# EAGLE design tracker (EAGLE 6.5.0)
GPS and Radio Tracker for Hot Air Balloon Flights Based on ATMega328p Microcrontroller and Raspberry Pi
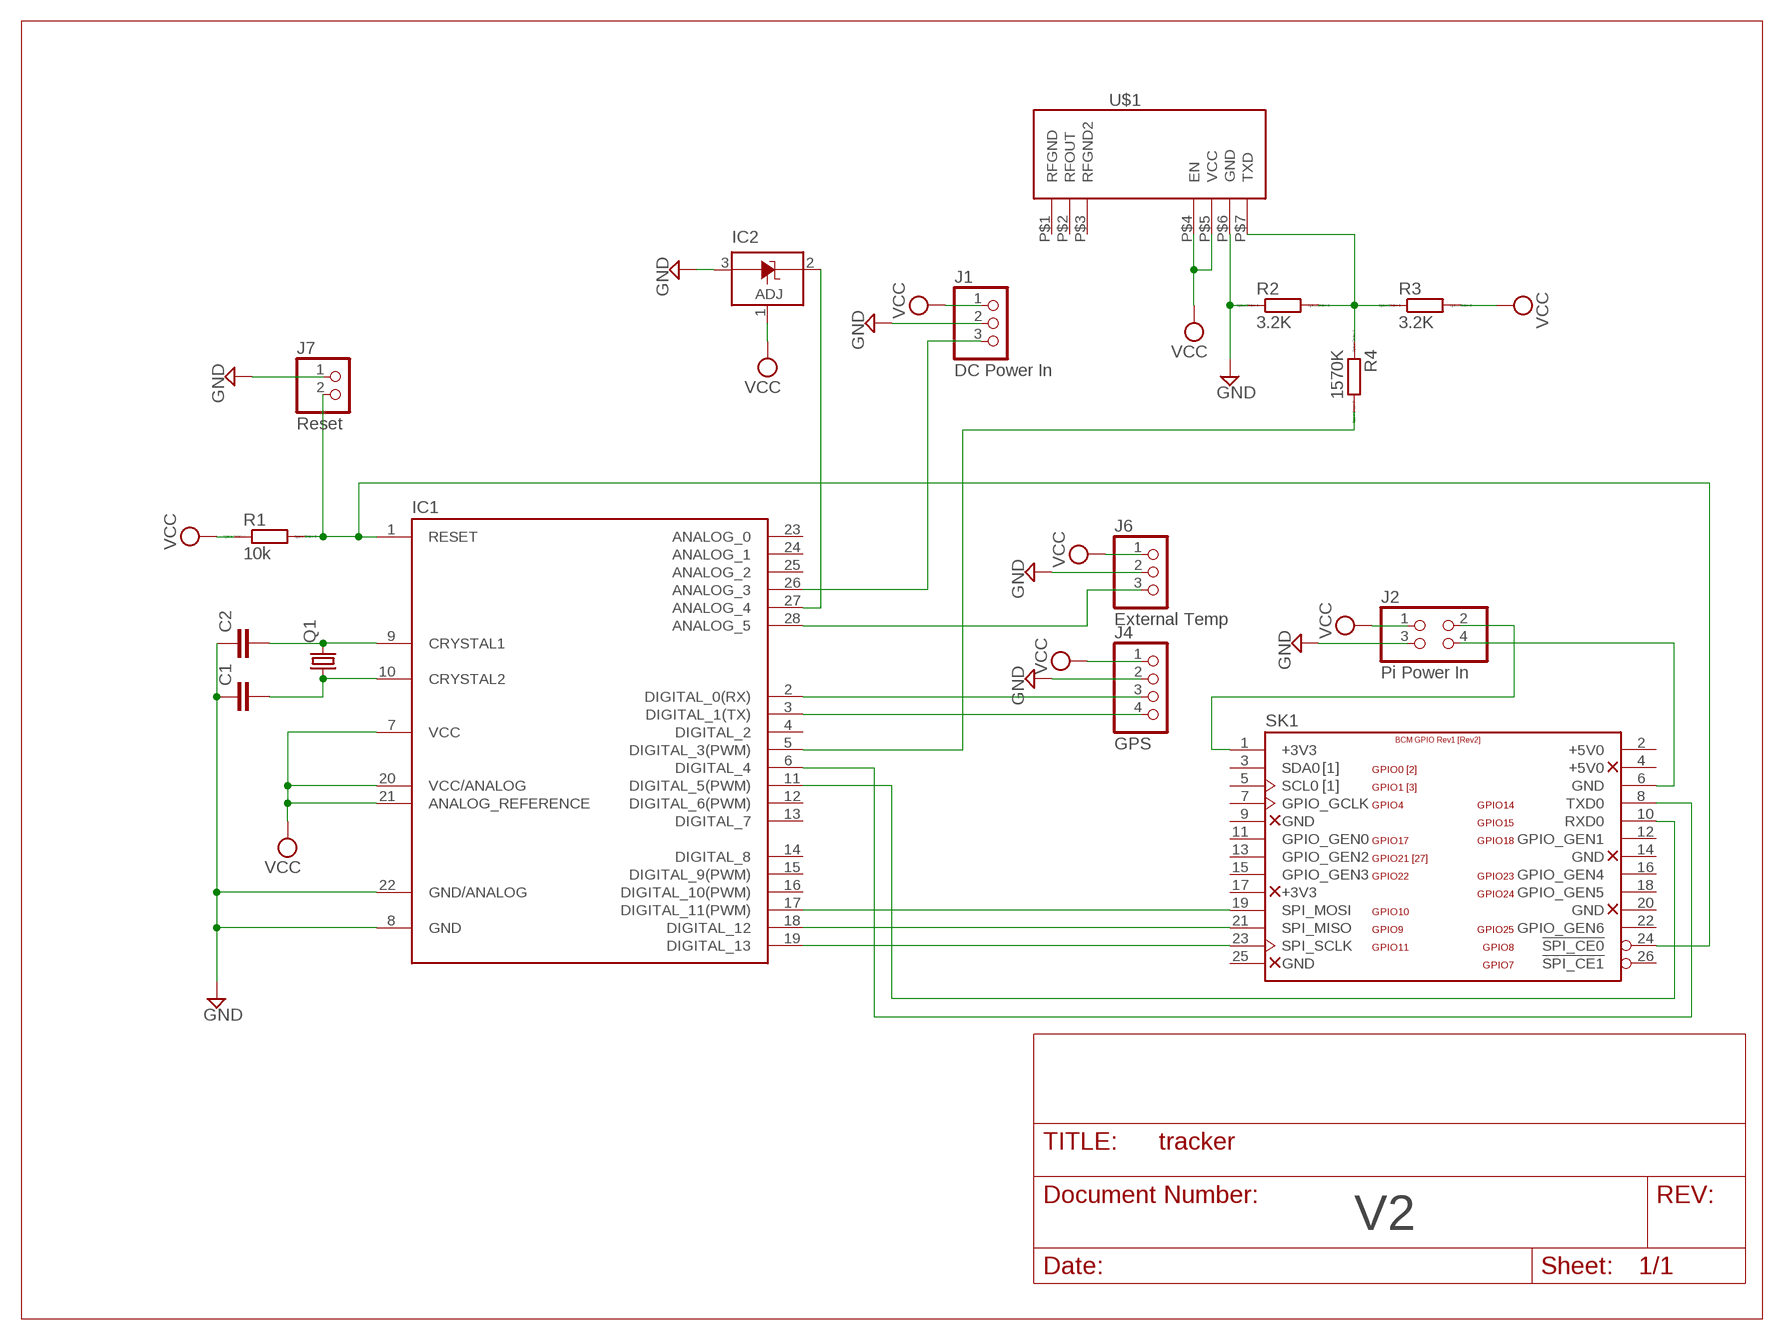
[diagram p0: schematic, sheet 1]

## Parts
C1  C-EU025-025X050  [C025-025X050]
C2  C-EU025-025X050  [C025-025X050]
IC1  ATMEGA168-PU  [DIL28-3]
IC2  LM336LP  [TO92]
J1  DC Power In  PINHD-1X3  [1X03]
J2  Pi Power In  PINHD-2X2  [2X02]
J4  GPS  PINHD-1X4  [1X04]
J6  External Temp  PINHD-1X3  [1X03]
J7  Reset  PINHD-1X2  [1X02]
Q1  CRYSTALHC49S  [HC49/S]
R1  10k  R0207/10  [0207/10]
R2  3.2K  R0207/10  [0207/10]
R3  3.2K  R0207/10  [0207/10]
R4  1570K  R0207/10  [0207/10]
SK1  PI-GPIO-PTH  [GPIO-CONNECTOR]
U$1  NTX2  [NTX2]

## Nets
GND: C1.1 C2.1 IC1.8(GND) IC1.22(GND/ANALOG) IC2.3(A) J1.2 J2.3 J4.2 J6.2 J7.1 R2.1 U$1.P$6(GND)
N$1: C2.2 IC1.9(CRYSTAL1) Q1.2
N$2: C1.2 IC1.10(CRYSTAL2) Q1.1
N$3: IC1.2(DIGITAL_0(RX)) J4.3
N$4: IC1.11(DIGITAL_5(PWM)) SK1.10(RXD0)
N$5: IC1.1(RESET) J7.2 R1.2 SK1.24(!SPI_CE0)
N$6: IC1.17(DIGITAL_11(PWM)) SK1.19(SPI_MOSI)
N$7: IC1.18(DIGITAL_12) SK1.21(SPI_MISO)
N$8: IC1.19(DIGITAL_13) SK1.23(SPI_SCLK)
N$9: IC1.3(DIGITAL_1(TX)) J4.4
N$10: IC1.5(DIGITAL_3(PWM)) R4.2
N$11: J2.2 SK1.1(+3V3)
N$12: J2.4 SK1.6(GND)
N$13: IC1.27(ANALOG_4) IC2.2(C)
N$14: IC1.26(ANALOG_3) J1.3
N$15: IC1.28(ANALOG_5) J6.3
N$16: R2.2 R3.1 R4.1 U$1.P$7(TXD)
N$17: IC1.6(DIGITAL_4) SK1.8(TXD0)
VCC: IC1.7(VCC) IC1.20(VCC/ANALOG) IC1.21(ANALOG_REFERENCE) IC2.1(ADJ) J1.1 J2.1 J4.1 J6.1 R1.1 R3.2 U$1.P$4(EN) U$1.P$5(VCC)
Unconnected: IC1.4(DIGITAL_2) IC1.12(DIGITAL_6(PWM)) IC1.13(DIGITAL_7) IC1.14(DIGITAL_8) IC1.15(DIGITAL_9(PWM)) IC1.16(DIGITAL_10(PWM)) IC1.23(ANALOG_0) IC1.24(ANALOG_1) IC1.25(ANALOG_2) SK1.3(SDA0) SK1.4(+5V0) SK1.5(SCL0) SK1.7(GPIO_GCLK) SK1.9(GND) SK1.11(GPIO_GEN0) SK1.12(GPIO_GEN1) SK1.13(GPIO_GEN2) SK1.14(GND) SK1.15(GPIO_GEN3) SK1.16(GPIO_GEN4) SK1.17(+3V3) SK1.18(GPIO_GEN5) SK1.20(GND) SK1.22(GPIO_GEN6) SK1.25(GND) SK1.26(!SPI_CE1) U$1.P$1(RFGND) U$1.P$2(RFOUT) U$1.P$3(RFGND2)

## Notes on the sheet
- V2

## Power pins joined to a net without a drawn wire
+5V0: SK1.2(+5V0)

## Library data of the parts
C1 C2 = rcl:C-EU: CAPACITOR, European symbol
IC1 = Arduino-AVR:ATMEGA168-PU
IC2 = linear:LM336: 2.5-V INTEGRATED REFERENCE CIRCUITS LM236 Source: http://focus.ti.com/lit/ds/symlink/lm336-2.5.pdf
J1 J6 = pinhead:PINHD-1X3: PIN HEADER
J2 = pinhead:PINHD-2X2: PIN HEADER
J4 = pinhead:PINHD-1X4: PIN HEADER
J7 = pinhead:PINHD-1X2: PIN HEADER
Q1 = crystal:CRYSTAL: CRYSTAL; OC_FARNELL: 1667008; OC_NEWARK: unknown
R1-R4 = eagle-ltspice:R: RESISTOR, European symbol; SPICEMODEL: NONE; SPICEPREFIX: R
SK1 = jt-raspberry-pi:PI-: Raspberry Pi
U$1 = Icarus:NTX2

## Board
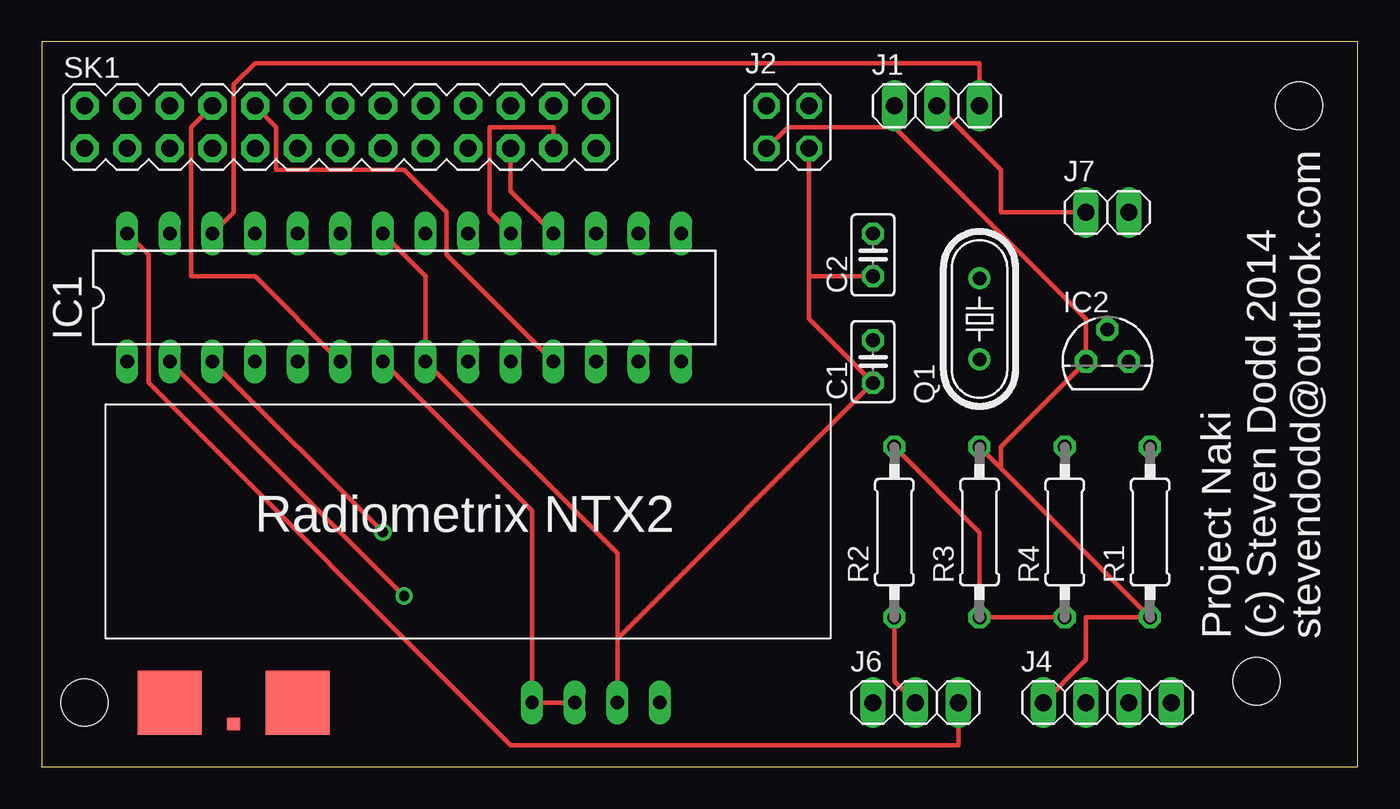
[diagram p1: board, top side]
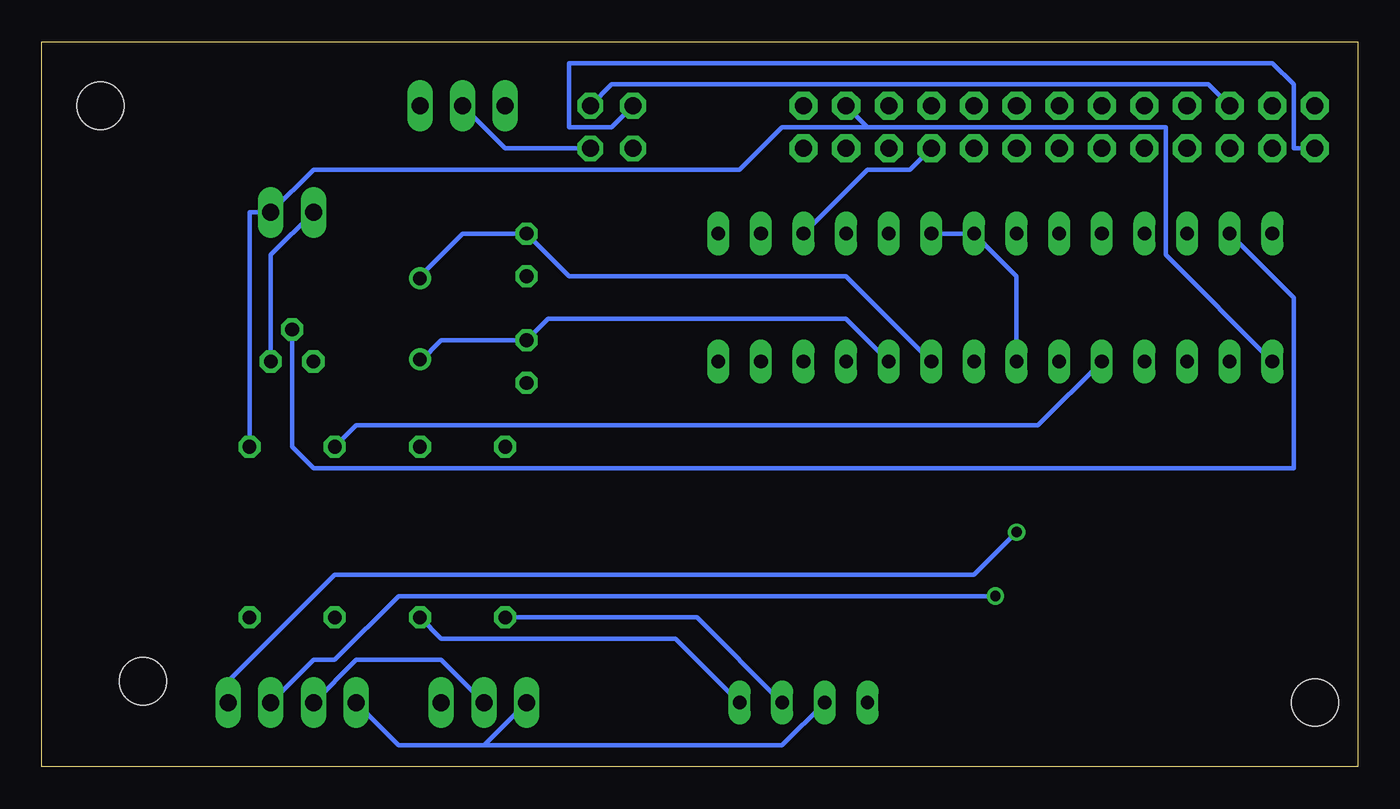
[diagram p2: board, bottom side, seen from below]

Size 78.41 x 43.17 mm. Coordinates in mm from the lower left corner, seen from the top.
Outline: 0,0 78.41,0 78.41,43.17 0,43.17 0,0
Copper layers (1*16): Top 0.035mm / dielectric 1.5mm / Bottom 0.035mm
Design rules "default": minimum track width 10mil, minimum drill 24mil, track to track 8mil, track to pad 8mil, pad to pad 8mil, via to via 8mil, smd to smd 8mil, copper to edge 40mil, drill to drill 8mil, minimum pad ring 10mil, minimum via ring 8mil, stop-mask expansion 4mil, vias tented up to drill 0mil, thermal gap 10mil
Holes 2.8 mm at 2.54,3.81 74.93,39.37 72.39,5.08

### Footprints (pad centres in the part's own frame; a part is rotated, then mirrored left to right if it is on the bottom)
C025-025X050 = drill 0.813 octagon: 1 -1.27,0; 2 1.27,0
DIL28-3 = drill 0.813 long: 1 -16.51,-3.81; 2 -13.97,-3.81; 3 -11.43,-3.81; 4 -8.89,-3.81; 5 -6.35,-3.81; 6 -3.81,-3.81; 7 -1.27,-3.81; 8 1.27,-3.81; 9 3.81,-3.81; 10 6.35,-3.81; 11 8.89,-3.81; 12 11.43,-3.81; 13 13.97,-3.81; 14 16.51,-3.81; 15 16.51,3.81; 16 13.97,3.81; 17 11.43,3.81; 18 8.89,3.81; 19 6.35,3.81; 20 3.81,3.81; 21 1.27,3.81; 22 -1.27,3.81; 23 -3.81,3.81; 24 -6.35,3.81; 25 -8.89,3.81; 26 -11.43,3.81; 27 -13.97,3.81; 28 -16.51,3.81
TO92 = drill 0.813 octagon: 1 -1.27,0; 2 0,1.905; 3 1.27,0
1X03 = drill 1.016 long: 1 -2.54,0; 2 0,0; 3 2.54,0
2X02 = drill 1.016 octagon: 1 -1.27,-1.27; 2 -1.27,1.27; 3 1.27,-1.27; 4 1.27,1.27
1X04 = drill 1.016 long: 1 -3.81,0; 2 -1.27,0; 3 1.27,0; 4 3.81,0
1X02 = drill 1.016 long: 1 -1.27,0; 2 1.27,0
HC49/S = drill 0.813: 1 -2.413,0; 2 2.413,0
0207/10 = drill 0.813 octagon: 1 -5.08,0; 2 5.08,0
GPIO-CONNECTOR = drill 1.016 pad 1.676 octagon: 1 -15.24,-1.27; 2 -15.24,1.27; 3 -12.7,-1.27; 4 -12.7,1.27; 5 -10.16,-1.27; 6 -10.16,1.27; 7 -7.62,-1.27; 8 -7.62,1.27; 9 -5.08,-1.27; 10 -5.08,1.27; 11 -2.54,-1.27; 12 -2.54,1.27; 13 0,-1.27; 14 0,1.27; 15 2.54,-1.27; 16 2.54,1.27; 17 5.08,-1.27; 18 5.08,1.27; 19 7.62,-1.27; 20 7.62,1.27; 21 10.16,-1.27; 22 10.16,1.27; 23 12.7,-1.27; 24 12.7,1.27; 25 15.24,-1.27; 26 15.24,1.27
NTX2 = smd 3.81 x 3.81: P$1 -11.43,-11.43; P$3 -3.81,-11.43 | smd 0.762 x 0.762: P$2 -7.62,-12.7 | drill 0.8 long: P$4 10.16,-11.43; P$5 12.7,-11.43; P$6 15.24,-11.43; P$7 17.78,-11.43

### Placement (x,y rotation side)
C1  49.53,24.13 90 top
C2  49.53,30.48 90 top
IC1  21.59,27.94 0 top
IC2  63.5,24.13 0 top
J1  53.34,39.37 0 top
J2  44.45,38.1 0 top
J4  63.5,3.81 0 top
J6  52.07,3.81 0 top
J7  63.5,33.02 0 top
Q1  55.88,26.67 90 top
R1  66.04,13.97 90 top
R2  50.8,13.97 90 top
R3  55.88,13.97 90 top
R4  60.96,13.97 90 top
SK1  17.78,38.1 0 top
U$1  19.05,15.24 0 top

### Tracks (layer width: path | path; a pad name or v marks a point on that pad's centre or on a via)
GND
  Top 0.254: J2.3 45.72,29.21 | 45.72,29.21 45.72,26.67 C1.1 34.29,7.62 | 45.72,29.21 C2.1 | J7.1 57.15,33.02 57.15,35.56 J1.2 | IC1.22 22.86,29.21 IC1.8 34.29,12.7 34.29,7.62 | J6.2 50.8,5.08 R2.1 | U$1.P$6 34.29,7.62
  Bottom 0.254: IC2.3 64.77,30.48 J7.1 | J1.2 50.8,36.83 J2.3 | U$1.P$6 39.37,8.89 R2.1 | J4.2 59.69,6.35 54.61,6.35 J6.2
N$1
  Bottom 0.254: IC1.9 30.48,29.21 46.99,29.21 C2.2 53.34,31.75 55.88,29.21 Q1.2
N$2
  Bottom 0.254: IC1.10 30.48,26.67 48.26,26.67 C1.2 54.61,25.4 55.88,24.13 Q1.1
N$3  (via drill 0.61)
  Top 0.254: v21.59,10.16 IC1.2
  Bottom 0.254: v21.59,10.16 57.15,10.16 60.96,6.35 62.23,6.35 J4.3
N$4
  Top 0.254: IC1.11 24.13,30.48 24.13,33.02 21.59,35.56 13.97,35.56 13.97,38.1 SK1.10
N$5
  Bottom 0.254: R1.2 66.04,33.02 J7.2 62.23,35.56 36.83,35.56 34.29,38.1 29.21,38.1 | IC1.1 11.43,30.48 11.43,38.1 29.21,38.1 | SK1.24 29.21,38.1
N$6
  Bottom 0.254: IC1.17 29.21,35.56 26.67,35.56 SK1.19
N$7
  Top 0.254: IC1.18 27.94,34.29 SK1.21
N$8
  Top 0.254: IC1.19 26.67,33.02 26.67,38.1 30.48,38.1 SK1.23
N$9  (via drill 0.61)
  Top 0.254: v20.32,13.97 IC1.3
  Bottom 0.254: v20.32,13.97 22.86,11.43 60.96,11.43 67.31,5.08 J4.4
N$10
  Bottom 0.254: IC1.5 19.05,20.32 59.69,20.32 R4.2
N$11
  Bottom 0.254: J2.2 44.45,38.1 46.99,38.1 46.99,41.91 5.08,41.91 3.81,40.64 3.81,36.83 SK1.1
N$12
  Bottom 0.254: J2.4 44.45,40.64 8.89,40.64 SK1.6
N$13
  Bottom 0.254: IC1.27 3.81,27.94 3.81,17.78 62.23,17.78 63.5,19.05 IC2.2
N$14
  Top 0.254: IC1.26 11.43,33.02 11.43,40.64 12.7,41.91 55.88,41.91 J1.3
N$15
  Top 0.254: IC1.28 6.35,30.48 6.35,22.86 27.94,1.27 54.61,1.27 J6.3
N$16
  Top 0.254: R4.1 R3.1 55.88,13.97 R2.2
  Bottom 0.254: U$1.P$7 40.64,7.62 54.61,7.62 R3.1
N$17
  Top 0.254: IC1.6 12.7,29.21 8.89,29.21 8.89,38.1 SK1.8
VCC
  Top 0.254: J2.1 44.45,38.1 50.8,38.1 | R3.2 57.15,17.78 | 57.15,17.78 R1.1 62.23,8.89 62.23,6.35 J4.1 | 57.15,17.78 57.15,19.05 IC2.1 62.23,26.67 50.8,38.1 | 50.8,38.1 J1.1 | U$1.P$5 U$1.P$4 29.21,15.24 IC1.7
  Bottom 0.254: IC1.7 20.32,29.21 IC1.21 IC1.20 | 52.07,1.27 J6.1 | 52.07,1.27 57.15,1.27 J4.1 | U$1.P$5 34.29,1.27 52.07,1.27

### Text on the board
tNames: Project Naki / (c) Steven Dodd 2014 / stevendodd@outlook.com